# Altium schematic sheet STN1170_RN-42 Toplevel Rev2.SchDoc: STN1110 RN-42 Bluetooth Board
size B; DrawnBy: AHonecker; Organization: AH Design; Address1: Designed and; Address2: Produced in NY; Address3: USA; DocumentNumber: 1; Revision: 1; SheetNumber: 1; SheetTotal: 3
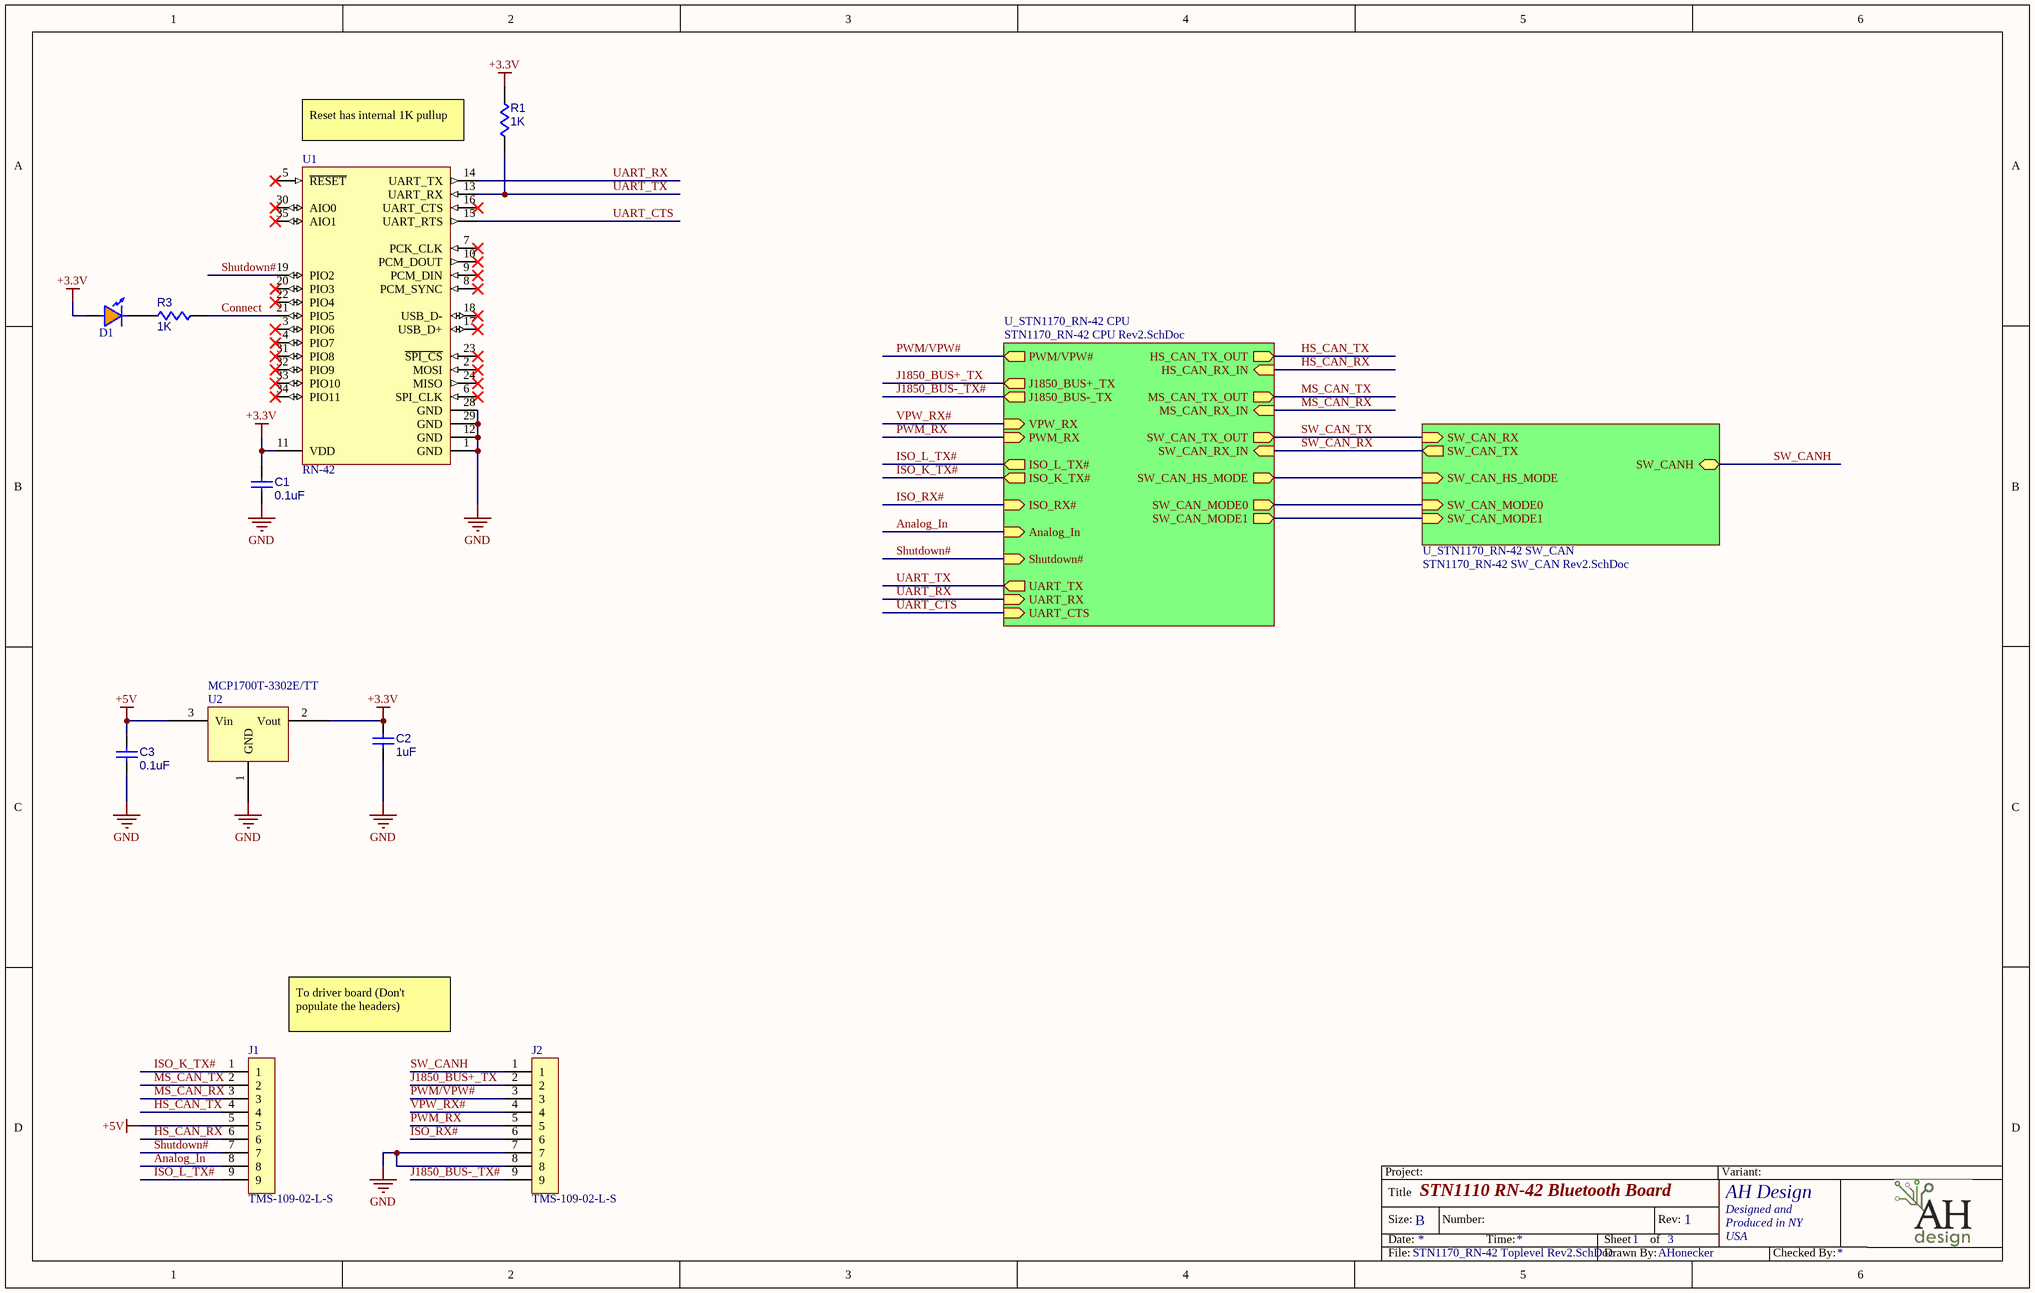
[diagram p0: STN1170_RN-42 Toplevel Rev2.SchDoc]

## Parts
C1  0.1uF  [CC0603]
C2  1uF  [CC0603]
C3  0.1uF  [CC0603]
D1  APA1606SECK  [KINGBRIGHT_APA1606SECK]  (value not drawn)
J1  TMS-109-02-L-S  [Samtec_TMS-109-02-L-S]  (no BOM)
J2  TMS-109-02-L-S  [Samtec_TMS-109-02-L-S]  (no BOM)
R1  1K  [R0603]
R3  1K  [R0603]
U1  RN-42  [RN-42]  (no BOM)
U2  MCP1700T-3302E/TT  [SOT23]

## Sub-sheets
U_STN1170_RN-42 CPU = STN1170_RN-42 CPU Rev2.SchDoc: J1850_BUS+_TX (out), J1850_BUS-_TX (out), PWM_RX (in), VPW_RX (in), PWM/VPW# (out), ISO_K_TX# (out), ISO_L_TX# (out), ISO_RX# (in), HS_CAN_TX_OUT (out), HS_CAN_RX_IN (in), MS_CAN_TX_OUT (out), MS_CAN_RX_IN (in), Analog_In (in), SW_CAN_RX_IN (in), SW_CAN_TX_OUT (out), SW_CAN_HS_MODE (out), SW_CAN_MODE0 (out), SW_CAN_MODE1 (out), Shutdown# (in), UART_TX (out), UART_RX (in), UART_CTS (in)
U_STN1170_RN-42 SW_CAN = STN1170_RN-42 SW_CAN Rev2.SchDoc: SW_CANH (bidir), SW_CAN_HS_MODE (in), SW_CAN_MODE0 (in), SW_CAN_MODE1 (in), SW_CAN_TX (out), SW_CAN_RX (in)

## Nets
+3.3V: C1.1 C2.2 D1.A R1.2 U1.11(VDD) U2.2(Vout)
+5V: C3.1 J1.5 U2.3(Vin)
GND: C1.2 C2.1 C3.2 J2.7 J2.8 U1.1(GND) U1.12(GND) U1.28(GND) U1.29(GND) U2.1(GND)
Analog_In: J1.8 ; sheet U_STN1170_RN-42 CPU/Analog_In
Connect: R3.2 U1.21(PIO5)
HS_CAN_RX: J1.6 ; sheet U_STN1170_RN-42 CPU/HS_CAN_RX_IN
HS_CAN_TX: J1.4 ; sheet U_STN1170_RN-42 CPU/HS_CAN_TX_OUT
ISO_K_TX#: J1.1 ; sheet U_STN1170_RN-42 CPU/ISO_K_TX#
ISO_L_TX#: J1.9 ; sheet U_STN1170_RN-42 CPU/ISO_L_TX#
ISO_RX#: J2.6 ; sheet U_STN1170_RN-42 CPU/ISO_RX#
J1850_BUS+_TX: J2.2 ; sheet U_STN1170_RN-42 CPU/J1850_BUS+_TX
J1850_BUS-_TX#: J2.9 ; sheet U_STN1170_RN-42 CPU/J1850_BUS-_TX
MS_CAN_RX: J1.3 ; sheet U_STN1170_RN-42 CPU/MS_CAN_RX_IN
MS_CAN_TX: J1.2 ; sheet U_STN1170_RN-42 CPU/MS_CAN_TX_OUT
PWM/VPW#: J2.3 ; sheet U_STN1170_RN-42 CPU/PWM/VPW#
PWM_RX: J2.5 ; sheet U_STN1170_RN-42 CPU/PWM_RX
Shutdown#: J1.7 U1.19(PIO2) ; sheet U_STN1170_RN-42 CPU/Shutdown#
SW_CAN_RX: sheet U_STN1170_RN-42 CPU/SW_CAN_RX_IN, sheet U_STN1170_RN-42 SW_CAN/SW_CAN_TX
SW_CAN_TX: sheet U_STN1170_RN-42 CPU/SW_CAN_TX_OUT, sheet U_STN1170_RN-42 SW_CAN/SW_CAN_RX
SW_CANH: J2.1 ; sheet U_STN1170_RN-42 SW_CAN/SW_CANH
UART_CTS: U1.15(UART_RTS) ; sheet U_STN1170_RN-42 CPU/UART_CTS
UART_RX: U1.14(UART_TX) ; sheet U_STN1170_RN-42 CPU/UART_RX
UART_TX: R1.1 U1.13(UART_RX) ; sheet U_STN1170_RN-42 CPU/UART_TX
VPW_RX#: J2.4 ; sheet U_STN1170_RN-42 CPU/VPW_RX
NetD1_C: D1.C R3.1
(unnamed): sheet U_STN1170_RN-42 CPU/SW_CAN_HS_MODE, sheet U_STN1170_RN-42 SW_CAN/SW_CAN_HS_MODE
(unnamed): sheet U_STN1170_RN-42 CPU/SW_CAN_MODE0, sheet U_STN1170_RN-42 SW_CAN/SW_CAN_MODE0
(unnamed): sheet U_STN1170_RN-42 CPU/SW_CAN_MODE1, sheet U_STN1170_RN-42 SW_CAN/SW_CAN_MODE1

Not connected (* = marked no-connect by the designer): U1 2(MOSI)* 3(PIO6)* 4(PIO7)* 5(~{RESET})* 6(SPI_CLK)* 7(PCK_CLK)* 8(PCM_SYNC)* 9(PCM_DIN)* 10(PCM_DOUT)* 16(UART_CTS)* 17(USB_D+)* 18(USB_D-)* 20(PIO3)* 22(PIO4)* 23(~{SPI_CS})* 24(MISO)* 30(AIO0)* 31(PIO8)* 32(PIO9)* 33(PIO10)* 34(PIO11)* 35(AIO1)*

## Notes on the sheet
- Reset has internal 1K pullup
- To driver board (Don't populate the headers)
- Project:
- Variant:
- Title
- Size:
- Date:
- B
- Number:
- Time:
- Sheet
- of
- Rev:
- File:
- Drawn By:
- Checked By:

## Library data of the parts
C1 C3 = 0.1uF,50V,CC0603,X7R,+/-20%: 0.1uF 50V, in a CC0603, X7R ,+/-20%,LF; Manufacturer: Kemet; PartNumber: C0603C104M5RAC; Voltage: 50; Designator: C?; Component Subkind: Capacitor; Approved: Pending; Value: 0.1uF; LeadFree: Yes; RoHS: Yes; Published: 7/18/2007; Publisher: AltiumdBManager; ItemID: 0.1uF,50V,CC0603,X7R,+/-20%; Component Kind: Standard; Component Type: Standard; Manufacturer2: CAL-CHIP; Manufacturer3: -; Manufacturer4: -; Pin Count: 2; PartNumber2: GMC10X7R10450NT-LF; Material: X7R; Tolerance: +/-20%; ComponentLink1URL: \PassivesDatasheets\F3102_CE.pdf; ComponentLink2URL: \PassivesDatasheets\gmc_series.pdf; ComponentLink3URL: -; ComponentLink4URL: -; ComponentLink1Description: Datasheet; ComponentLink2Description: Datasheet; ComponentLink3Description: Datasheet; ComponentLink4Description: Datasheet
C2 = 1uF,6.3V,CC0603,X7R,+/-20%: 1uF 6.3V, in a CC0603, X7R ,+/-20%,LF; Manufacturer: Kemet Electronics Corp; PartNumber: C0603C105M9RAC; PartStatus1: Active; Voltage: 6.3; Designator: C?; Component Subkind: Capacitor; Approved: Yes; ItemWeight1_mg: 240.300003051758; ItemWeight2_mg: 0; Approver: IHS; Value: 1uF; LeadFree: Yes; RoHS: Yes; Published: 1/5/2011 12:07:09 PM; Publisher: AltiumDBManager1.4-MWyman; ItemID: 1uF,6.3V,CC0603,X7R,+/-20%; Component Kind: Standard; Component Type: Standard; Manufacturer2: Cal-Chip Electronics; Manufacturer3: -; Manufacturer4: -; Pin Count: 2; Material: X7R; PartNumber3: -; Tolerance: +/-20%; PartNumber4: -; Status: Active; ComponentLink1URL: \PassivesDatasheets\F3102_CE.pdf; ComponentLink2URL: \PassivesDatasheets\gmc_series.pdf; ComponentLink3URL: -; ComponentLink4URL: -; ComponentLink1Description: Datasheet; ComponentLink2Description: Datasheet; ComponentLink3Description: Datasheet; ComponentLink4Description: Datasheet; PartStatus3: -; PartStatus4: -; ItemWeight3_mg: 0; ItemWeight4_mg: 0
D1 = KINGBRIGHT_APA1606SECK: LED 1.6X0.6MM 601NM Orange Right-Angle SMD; Manufacturer: Kingbright Corp.; Approved: No; TargetLibrary: LEDs; Value: 2.1V; ComponentLink1Description: Datasheet; ComponentLink1URL: http://www.us.kingbright.com/images/catalog/SPEC/APA1606SECK.pdf; LeadFree: Yes; PartNumber: APA1606SECK; Published: 1/18/2010; Publisher: Vanteon - AHonecker; RoHS: Yes; Status: Active
J1 J2 = Samtec_TMS-109-02-L-S: 9 pin through hole micro header, 50mil pitch; Manufacturer: Samtec; PartNumber: TMS-109-02-L-S
R1 R3 = 1K,R0603,5%: 1K, Gen Purp Chip, R0603 0.1W 5%; Manufacturer: Panasonic; PartNumber: ERJ3GEYJ102V; Component SubKind: Resistor; Voltage: 75; MetricFootprint: R1608MM; Value: 1K; Manufacturer2: Vishay/Dale; Manufacturer3: KOA/Speer; Manufacturer4: ROHM; PartNumber2: CRCW06031KJKED; PartNumber3: RK73B1JTTD102J; PartNumber4: MCR03EZPJ102; Tolerance: 5%; Material: Thick-Film; Watts: 0.1W; LeadFree: Yes; RoHS: Yes; Published: 7/16/2009; Publisher: AltiumDBManager1.1; ItemID: 1K,R0603,5%; Component Kind: Standard; Component Type: Standard; Pin Count: 2; Spice Prefix: R; ComponentLink1URL: http://industrial.panasonic.com/www-data/pdf/AOA0000/AOA0000CE1.pdf; ComponentLink2URL: \PassivesDatasheets\Vishay_dcrcw.pdf; ComponentLink3URL: \PassivesDatasheets\KOA_Speer_2%_5%.pdf; ComponentLink4URL: \PassivesDatasheets\mcr03.pdf; ComponentLink1Description: Datasheet; ComponentLink2Description: Datasheet; ComponentLink3Description: Datasheet; ComponentLink4Description: Datasheet
U1 = RN-42: Roving Networks Bluetooth Serial Module; Manufacturer: Roving Networks; PartNumber: RN-42
U2 = MCP1700T-3302E/TT: IC LDO REG 250MA 3.3V SOT-23-3; Manufacturer: Microchip Technology; PartNumber: MCP1700T-3302E/TT